# EAGLE design Adafruit LIS3MDL + LSM6DSOX FeatherWing (EAGLE 9.5.1)
COMPANY: ADAFRUIT INDUSTRIES; DRAWN: KTOWN; REV: A
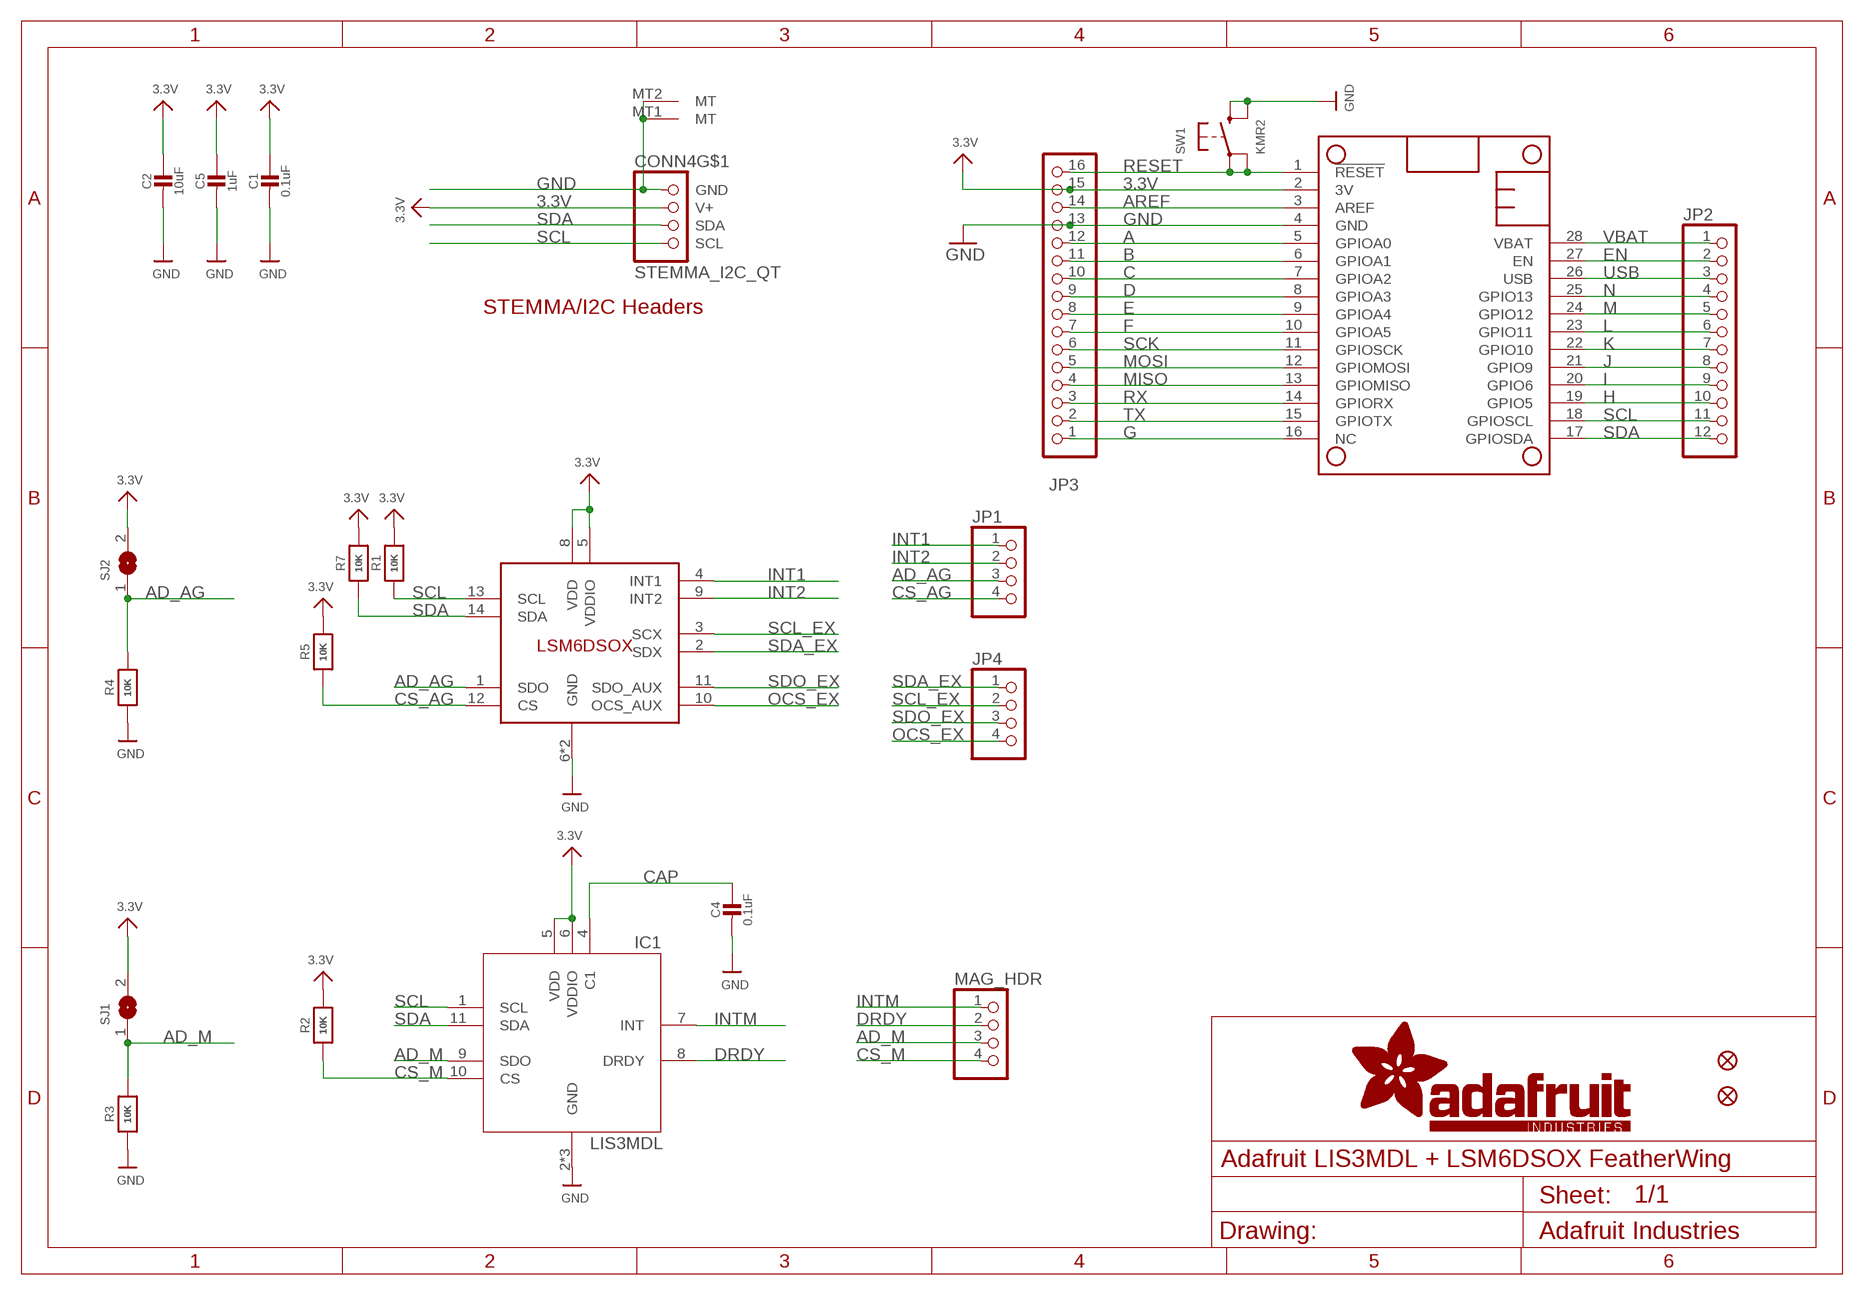
[diagram p0: schematic, sheet 1]

## Parts
C1  0.1uF  CAP_CERAMIC0603_NO  [0603-NO]
C2  10uF  CAP_CERAMIC0805-NOOUTLINE  [0805-NO]
C4  0.1uF  CAP_CERAMIC0603_NO  [0603-NO]
C5  1uF  CAP_CERAMIC0603_NO  [0603-NO]
CONN4  STEMMA_I2C_QT  [JST_SH4]
FID1  FIDUCIAL_1MM  [FIDUCIAL_1MM]
FID2  FIDUCIAL_1MM  [FIDUCIAL_1MM]
IC1  LIS3MDL  [LGA12_2X2MM]
JP1  HEADER-1X4ROUND  [1X04_ROUND]
JP2  HEADER-1X12  [1X12_ROUND]
JP3  HEADER-1X16ROUND  [1X16_ROUND]
JP4  HEADER-1X4ROUND  [1X04_ROUND]
MAG_HDR  HEADER-1X4ROUND  [1X04_ROUND]
MS1  FEATHERWING  [FEATHERWING]
R1  10K  RESISTOR_0603_NOOUT  [0603-NO]
R2  10K  RESISTOR_0603_NOOUT  [0603-NO]
R3  10K  RESISTOR_0603_NOOUT  [0603-NO]
R4  10K  RESISTOR_0603_NOOUT  [0603-NO]
R5  10K  RESISTOR_0603_NOOUT  [0603-NO]
R7  10K  RESISTOR_0603_NOOUT  [0603-NO]
SJ1  SOLDERJUMPER  [SOLDERJUMPER_ARROW_NOPASTE]
SJ2  SOLDERJUMPER  [SOLDERJUMPER_ARROW_NOPASTE]
SW1  KMR2  SWITCH_TACT_SMT4.6X2.8  [BTN_KMR2_4.6X2.8]
U$35  LSM6DSOX  [LGA-14L]

## Nets
3.3V [lowpower]: C1.1 C2.1 C5.1 CONN4.2(V+) IC1.5(VDD) IC1.6(VDDIO) JP3.15 MS1.2(3V) R1.2 R2.2 R5.2 R7.2 SJ1.2 SJ2.2 U$35.5(VDDIO) U$35.8(VDD)
A: JP3.12 MS1.5(GPIOA0)
AD_AG: JP1.3 R4.2 SJ2.1 U$35.1(SDO)
AD_M: IC1.9(SDO) MAG_HDR.3 R3.2 SJ1.1
AREF: JP3.14 MS1.3(AREF)
B: JP3.11 MS1.6(GPIOA1)
C: JP3.10 MS1.7(GPIOA2)
CAP: C4.1 IC1.4(C1)
CS_AG: JP1.4 R5.1 U$35.12(CS)
CS_M: IC1.10(CS) MAG_HDR.4 R2.1
D: JP3.9 MS1.8(GPIOA3)
DRDY: IC1.8(DRDY) MAG_HDR.2
E: JP3.8 MS1.9(GPIOA4)
EN: JP2.2 MS1.27(EN)
F: JP3.7 MS1.10(GPIOA5)
G: JP3.1 MS1.16(NC)
GND [lowpower]: C1.2 C2.2 C4.2 C5.2 CONN4.1(GND) CONN4.MT1(MT) CONN4.MT2(MT) IC1.2(GND) IC1.3(GND) IC1.12(GND) JP3.13 MS1.4(GND) R3.1 R4.1 SW1.B'(S1) SW1.B(S) U$35.6(GND) U$35.7(GND)
H: JP2.10 MS1.19(GPIO5)
I: JP2.9 MS1.20(GPIO6)
INT1: JP1.1 U$35.4(INT1)
INT2: JP1.2 U$35.9(INT2)
INTM: IC1.7(INT) MAG_HDR.1
J: JP2.8 MS1.21(GPIO9)
K: JP2.7 MS1.22(GPIO10)
L: JP2.6 MS1.23(GPIO11)
M: JP2.5 MS1.24(GPIO12)
MISO: JP3.4 MS1.13(GPIOMISO)
MOSI: JP3.5 MS1.12(GPIOMOSI)
N: JP2.4 MS1.25(GPIO13)
OCS_EX: JP4.4 U$35.10(OCS_AUX)
RESET: JP3.16 MS1.1(!RESET) SW1.A'(P1) SW1.A(P)
RX: JP3.3 MS1.14(GPIORX)
SCK: JP3.6 MS1.11(GPIOSCK)
SCL: CONN4.4(SCL) IC1.1(SCL) JP2.11 MS1.18(GPIOSCL) R1.1 U$35.13(SCL)
SCL_EX: JP4.2 U$35.3(SCX)
SDA: CONN4.3(SDA) IC1.11(SDA) JP2.12 MS1.17(GPIOSDA) R7.1 U$35.14(SDA)
SDA_EX: JP4.1 U$35.2(SDX)
SDO_EX: JP4.3 U$35.11(SDO_AUX)
TX: JP3.2 MS1.15(GPIOTX)
USB: JP2.3 MS1.26(USB)
VBAT: JP2.1 MS1.28(VBAT)

## Notes on the sheet
- STEMMA/I2C Headers

## Library data of the parts
C1 C2 C4 C5 = microbuilder:CAP_CERAMIC: Ceramic Capacitors For new designs, use the packages preceded by an '_' character since they are more reliable: The following footprints should be used on most boards: _0402 - Standard footprint for regular board layouts _0603 - Standard footprint for regular board layouts _0805 - Standard footprint for regular board layouts _1206 - Standard footprint for regular board layouts For extremely tight-pitch boards where space is at a premium, the following 'micro-pitch' footprints can be used (smaller pads, no silkscreen outline, etc.): _0402MP - Micro-pitch footprint for very dense/compact boards _0603MP - Micro-pitch footprint for very dense/compact boards _0805MP - Micro-pitch footprint for very dense/compact boards _1206MP - Micro-pitch footprint for very dense/compact boards
CONN4 = microbuilder:STEMMA_I2C
FID1 FID2 = microbuilder:FIDUCIAL: Fiducial Alignment Points Various fiducial points for machine vision alignment.; BOM: EXCLUDE
IC1 = adafruit_sensor:LIS3MDL: Digital output magnetic sensor. ultra-low-power, high-performance 3-axis magnetometer
JP1 JP4 MAG_HDR = microbuilder:HEADER-1X4: PIN HEADER
JP2 = microbuilder:HEADER-1X12
JP3 = microbuilder:HEADER-1X16: PIN HEADER
MS1 = microbuilder:FEATHERWING
R1-R5 R7 = microbuilder:RESISTOR: Resistors For new designs, use the packages preceded by an '_' character since they are more reliable: The following footprints should be used on most boards: _0402 - Standard footprint for regular board layouts _0603 - Standard footprint for regular board layouts _0805 - Standard footprint for regular board layouts _1206 - Standard footprint for regular board layouts For extremely tight-pitch boards where space is at a premium, the following 'micro-pitch' footprints can be used (smaller pads, no silkscreen outline, etc.): _0402MP - Micro-pitch footprint for very dense/compact boards _0603MP - Micro-pitch footprint for very dense/compact boards _0805MP - Micro-pitch footprint for very dense/compact boards _1206MP - Micro-pitch footprint for very dense/compact boards
SJ1 SJ2 = microbuilder:SOLDERJUMPER: SMD Solder JUMPER Solder the two pads together to create a connection, or remove the solder to break it. REFLOW - Use this footprint for solder paste and reflow ovens. WAVE - Use this footprint for hand-soldering (larger pads). CLOSED - Has a trace between the two pads to ensure it is closed by default. The trace needs to be cut to disable the jumper, and can be closed again by creating a solder bridge between the two pads.; BOM: EXCLUDE
SW1 = microbuilder:SWITCH_TACT_SMT: SMT Tact Switches 6x6mm - Digikey: P12940SCT-ND KMR2 (4.6x2.8mm) - Digikey: 401-1426-1-ND EVQ-PQHB55 - Light Touch, 160GF (4.5x4.5mm) - Digikey: P8090SCT-ND KMT0 - KMT021 NGJ LHS (etc.) IP68/Waterproof - Digikey: CKN10289CT-ND
U$35 = adafruit_sensor:LSM6DSOX

## Net classes
1 highpower: width 0.406 mm, drill 0.483 mm
2 lowpower: width 0.305 mm, drill 0.483 mm

## Board
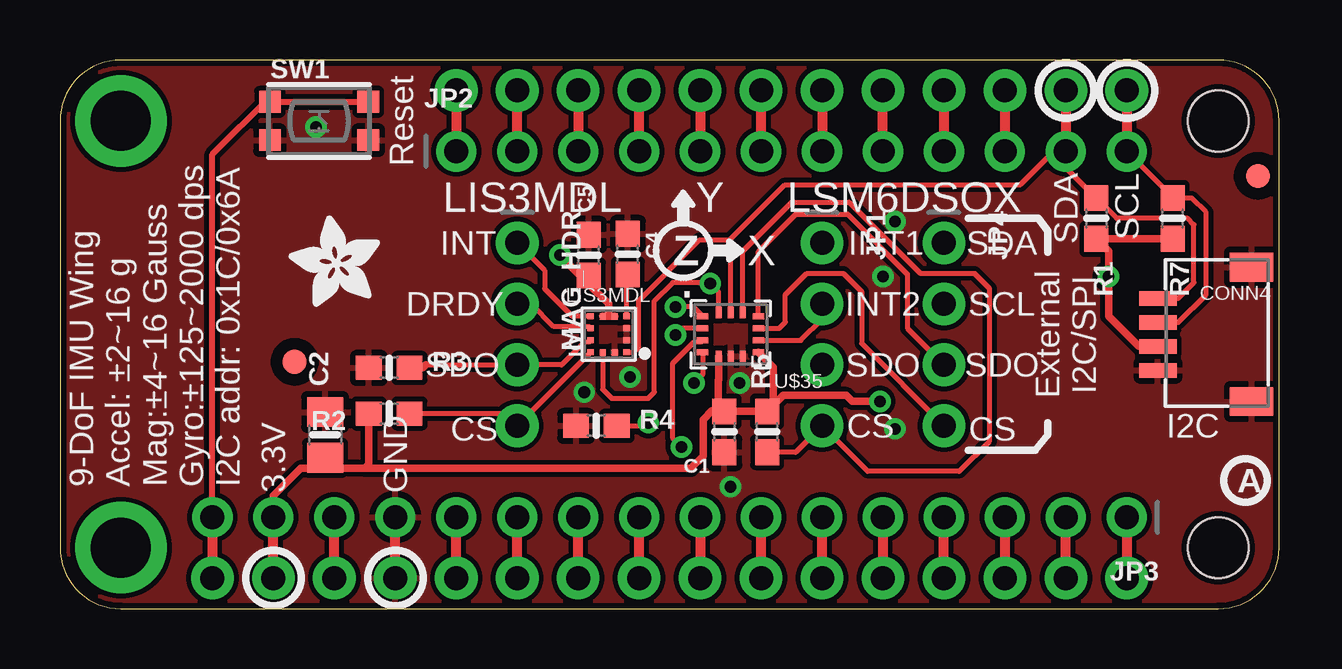
[diagram p1: board, top side]
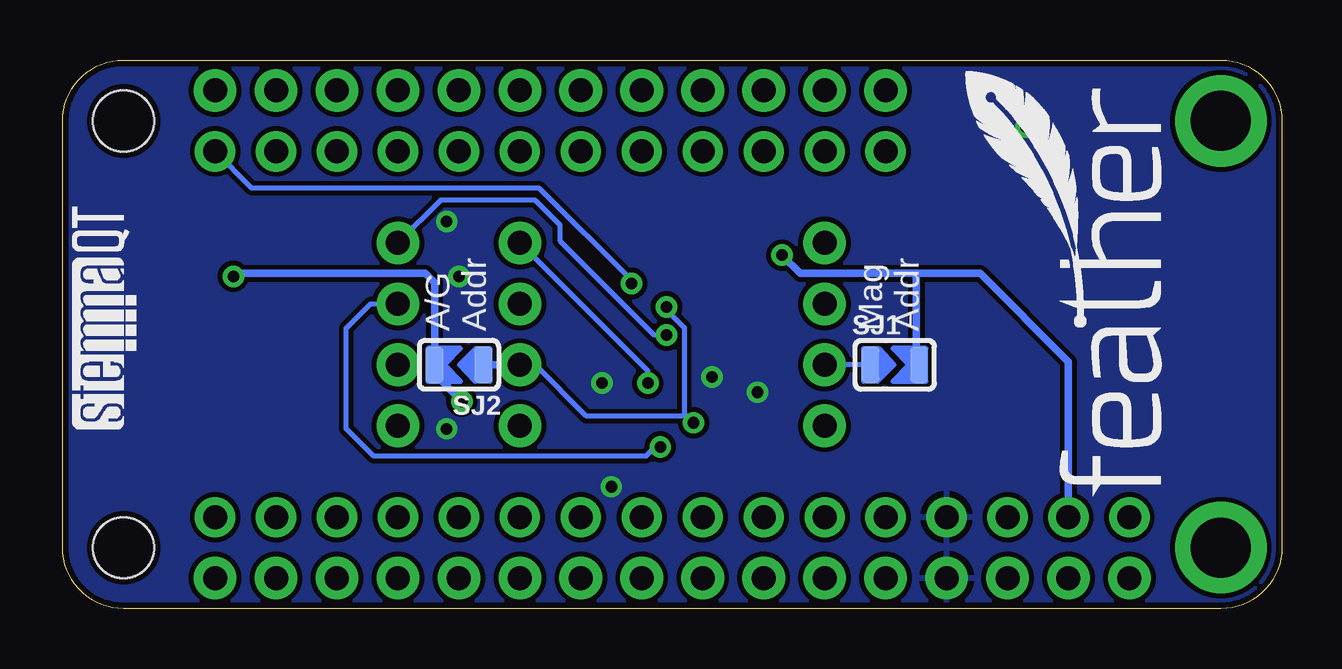
[diagram p2: board, bottom side, seen from below]

Size 50.8 x 22.86 mm. Coordinates in mm from the lower left corner, seen from the top.
Copper layers (1*16): Top 0.035mm / dielectric 1.5mm / Bottom 0.035mm
Design rules "adafruit *": minimum track width 8mil, minimum drill 15.5mil, track to track 8mil, track to pad 8mil, pad to pad 8mil, via to via 8mil, smd to smd 8mil, copper to edge 10mil, drill to drill 8mil, minimum pad ring 10mil, minimum via ring 8mil, stop-mask expansion 2mil, vias tented up to drill 20mil, thermal gap 10mil

### Footprints (pad centres in the part's own frame; a part is rotated, then mirrored left to right if it is on the bottom)
0603-NO = smd 1.075 x 1: 1 -0.85,0; 2 0.85,0
0805-NO = smd 1.24 x 1.5: 1 -0.95,0; 2 0.95,0
JST_SH4 = smd 0.6 x 1.55: 1 -1.5,2.514; 2 -0.5,2.514; 3 0.5,2.514; 4 1.5,2.514 | smd 1.2 x 1.8: MT1 -2.8,-1.386; MT2 2.8,-1.386
FIDUCIAL_1MM = smd 1 x 1: 1 0,0
LGA12_2X2MM = smd 0.275 x 0.25: 1 -0.75,0.75; 2 -0.75,0.25; 3 -0.75,-0.25; 4 -0.75,-0.75; 7 0.75,-0.75; 8 0.75,-0.25; 9 0.75,0.25; 10 0.75,0.75 | smd 0.25 x 0.275: 5 -0.25,-0.75; 6 0.25,-0.75; 11 0.25,0.75; 12 -0.25,0.75
1X04_ROUND = drill 1 pad 1.778: 1 -3.81,0; 2 -1.27,0; 3 1.27,0; 4 3.81,0
1X12_ROUND = drill 1 pad 1.676: 1 -13.97,0; 2 -11.43,0; 3 -8.89,0; 4 -6.35,0; 5 -3.81,0; 6 -1.27,0; 7 1.27,0; 8 3.81,0; 9 6.35,0; 10 8.89,0; 11 11.43,0; 12 13.97,0
1X16_ROUND = drill 1 pad 1.676: 1 -19.05,0; 2 -16.51,0; 3 -13.97,0; 4 -11.43,0; 5 -8.89,0; 6 -6.35,0; 7 -3.81,0; 8 -1.27,0; 9 1.27,0; 10 3.81,0; 11 6.35,0; 12 8.89,0; 13 11.43,0; 14 13.97,0; 15 16.51,0; 16 19.05,0
FEATHERWING = drill 1 pad 1.778: 1 6.35,1.27; 2 8.89,1.27; 3 11.43,1.27; 4 13.97,1.27; 5 16.51,1.27; 6 19.05,1.27; 7 21.59,1.27; 8 24.13,1.27; 9 26.67,1.27; 10 29.21,1.27; 11 31.75,1.27; 12 34.29,1.27; 13 36.83,1.27; 14 39.37,1.27; 15 41.91,1.27; 16 44.45,1.27; 17 44.45,21.59; 18 41.91,21.59; 19 39.37,21.59; 20 36.83,21.59; 21 34.29,21.59; 22 31.75,21.59; 23 29.21,21.59; 24 26.67,21.59; 25 24.13,21.59; 26 21.59,21.59; 27 19.05,21.59; 28 16.51,21.59 | drill 2.5 pad 3.81: P$1 2.54,20.32; P$2 2.54,2.54 | hole 2.54: 48.26,20.32; 48.26,2.54
SOLDERJUMPER_ARROW_NOPASTE = smd 0.762 x 1.524: 1 -1.016,0; 2 1.016,0
BTN_KMR2_4.6X2.8 = smd 0.9 x 0.9: A 2.05,0.8; A' -2.05,0.8; B 2.05,-0.8; B' -2.05,-0.8
LGA-14L = smd 0.475 x 0.25: 1 -1.163,0.75; 2 -1.163,0.25; 3 -1.163,-0.25; 4 -1.163,-0.75; 8 1.163,-0.75; 9 1.163,-0.25; 10 1.163,0.25; 11 1.163,0.75 | smd 0.25 x 0.475: 5 -0.5,-0.912; 6 0,-0.912; 7 0.5,-0.912; 12 0.5,0.912; 13 0,0.912; 14 -0.5,0.912

### Placement (x,y rotation side)
C1  27.69,7.37 270 top
C2  11.05,7.24 90 top
C4  23.66,14.77 90 top
C5  22.03,14.73 90 top
CONN4  48.26,11.43 90 top
FID1  9.78,10.29 0 top
FID2  49.91,18.03 0 top
IC1  22.86,11.43 180 top
JP1  31.75,11.43 270 top
JP2  30.48,19.05 0 top
JP3  25.4,3.81 180 top
JP4  36.83,11.43 270 top
MAG_HDR  19.05,11.43 270 top
MS1  0,0 0 top
R1  43.18,16.26 270 top
R2  13.72,8.13 180 top
R3  13.72,10.03 0 top
R4  22.35,7.62 0 top
R5  29.46,7.37 90 top
R7  46.35,16.26 270 top
SJ1  16.13,10.16 0 bottom
SJ2  34.29,10.16 180 bottom
SW1  10.79,20.32 0 top
U$13  [FEATHERLOGO_MED]  4.95,4.57 90 bottom
U$31  [STEMMAQT]  47.75,7.49 90 bottom
U$35  27.94,11.43 0 top
U$50  [ADAFRUIT_3.5MM]  13.34,12.57 90 top
U$51  [PCBFEAT-REV-040]  49.4,5.33 0 top

### Tracks (layer width: path | path; a pad name or v marks a point on that pad's centre or on a via)
3.3V  (via drill 0.48)
  Top 0.305: U$35.5 27.44,9.53 27.43,9.53 27.43,8.47 27.67,8.24 | U$35.8 29.72,10.06 29.72,8.47 | IC1.5 22.86,12.18 | 22.86,12.18 IC1.6 | 22.86,12.18 22.86,12.7 22.1,13.46 | 22.1,13.46 21.97,13.59 | 21.97,13.59 v20.83,14.73 | 12.7,5.84 26.29,5.84 26.8,6.35 26.8,7.87 27.16,8.24 27.67,8.24 | 12.7,5.84 11.05,5.84 | 11.05,5.84 10.03,5.84 8.89,4.7 JP3.15 | R7.2 R1.2 43.69,14.9 v43.69,13.84 43.69,12.19 44.95,10.93 CONN4.2 | 22.1,13.46 22.1,13.82 C5.1 21.97,13.82 21.97,13.59 | R2.2 12.87,6.01 12.7,5.84 | v34.16,8.64 33.02,8.64 32.77,8.89 30.14,8.89 29.72,8.47 | 29.72,8.47 R5.2 C1.1 27.67,8.24 | C2.1 11.05,5.84
  Top 0.406: MS1.2 JP3.15
  Bottom 0.305: v20.83,14.73 20.07,13.97 15.24,13.97 | 15.24,13.97 12.57,13.97 8.89,10.29 JP3.15 | 15.24,13.97 15.24,10.29 SJ1.2 | v43.69,13.84 43.56,13.97 35.69,13.97 35.31,13.59 SJ2.2 35.31,9.78 v34.16,8.64
A
  Top 0.406: MS1.5 JP3.12
AD_AG  (via drill 0.48)
  Top 0.203: U$35.1 26.38,12.57 v25.64,12.57 | R4.2 24.38,7.62 v24.51,7.75
  Bottom 0.203: v25.64,12.57 25.64,12.46 24.89,11.71 24.89,8.13 | 24.89,8.13 24.89,8.02 28.98,8.02 31.11,10.16 JP1.3 | v24.51,7.75 24.89,8.13
  Bottom 0.305: SJ2.1 JP1.3
AD_M
  Top 0.203: IC1.9 22.04,11.11 21.85,11.11 20.9,10.16 MAG_HDR.3 15.24,10.16
  Top 0.305: 15.24,10.16 15.11,10.03 R3.2
  Bottom 0.203: SJ1.1 MAG_HDR.3
AREF
  Top 0.406: MS1.3 JP3.14
B
  Top 0.406: MS1.6 JP3.11
C
  Top 0.406: MS1.7 JP3.10
CAP
  Top 0.203: IC1.4 23.61,13.87 C4.1
CS_AG
  Top 0.203: U$35.12 28.44,14.89 30.49,16.94 32.88,16.94 35.85,13.97 38.1,13.97 38.73,13.34 38.73,6.99 37.47,5.71 33.66,5.71 JP1.4 30.65,6.52 R5.1
CS_M
  Top 0.203: IC1.10 MAG_HDR.4 18.54,8.13 R2.1
D
  Top 0.406: MS1.8 JP3.9
DRDY
  Top 0.203: IC1.8 22.04,11.75 20.58,11.75 19.63,12.7 MAG_HDR.2
E
  Top 0.406: JP3.8 MS1.9
EN
  Top 0.406: JP2.2 MS1.27
F
  Top 0.406: MS1.10 JP3.7
G
  Top 0.406: JP3.1 MS1.16
GND  (via drill 0.48)
  Top 0.406: MS1.4 JP3.13
  other vias: 10.67,20.07 21.84,9.02 23.75,9.65 28.32,9.4 34.29,13.84 34.8,7.49 34.8,16.13 27.94,5.08
  pour Top: 0,22.86 50.8,22.86 50.8,0 0,0
  pour Bottom: 0,22.86 50.8,22.86 50.8,0 0,0
H
  Top 0.406: MS1.19 JP2.10
I
  Top 0.406: MS1.20 JP2.9
INT1  (via drill 0.48)
  Top 0.203: U$35.4 26.78,9.76 v26.42,9.4
  Bottom 0.203: v26.42,9.4 26.42,9.91 JP1.1
INT2
  Top 0.203: U$35.9 30.86,11.18 31.75,12.06 JP1.2
INTM
  Top 0.203: IC1.7 21.35,12.18 20.19,13.34 20.19,14.1 MAG_HDR.1
J
  Top 0.406: JP2.8 MS1.21
K
  Top 0.406: MS1.22 JP2.7
L
  Top 0.406: JP2.6 MS1.23
M
  Top 0.406: MS1.24 JP2.5
MISO
  Top 0.406: MS1.13 JP3.4
MOSI
  Top 0.406: JP3.5 MS1.12
N
  Top 0.406: JP2.4 MS1.25
OCS_EX
  Top 0.203: JP4.4 33.4,11.05 33.4,13.21 32.64,13.97 31.11,13.97 30.23,13.08 30.23,11.94 29.97,11.68 U$35.10
RESET
  Top 0.254: JP3.16 6.35,18.92 8.74,21.32 SW1.A' SW1.A
  Top 0.406: JP3.16 MS1.1
RX
  Top 0.406: JP3.3 MS1.14
SCK
  Top 0.406: MS1.11 JP3.6
SCL
  Top 0.203: IC1.1 23.62,10.67 23.88,10.67 24.11,10.9 24.11,12.83 26.64,15.37 27.91,15.37 | 27.91,15.37 30.2,17.65 40.01,17.65 41.4,19.05 JP2.11 41.91,18.38 R1.1 44.03,16.26 46.99,16.26 47.24,16 47.24,13.59 46.59,12.93 CONN4.4 | 27.91,15.37 27.94,15.37 U$35.13
  Top 0.406: MS1.18 JP2.11
SCL_EX  (via drill 0.48)
  Top 0.203: U$35.3 26.71,11.11 26.41,11.11 25.52,10.21 25.52,7.12 v25.9,6.74
  Bottom 0.203: v25.9,6.74 26.11,6.74 26.5,6.35 37.85,6.35 38.99,7.49 38.99,11.68 37.97,12.7 JP4.2
SDA  (via drill 0.48)
  Top 0.203: U$35.14 27.44,13.2 v27.09,13.55 27.05,13.59 25.53,13.59 24.77,12.83 24.77,9.02 24.51,8.76 22.99,8.76 22.61,9.14 IC1.11 | JP2.12 46.35,17.14 R7.1 47.16,17.11 47.75,16.51 47.75,13.08 46.6,11.93 CONN4.3
  Top 0.406: MS1.17 JP2.12
  Bottom 0.203: v27.09,13.55 27.09,13.67 30.94,17.53 42.93,17.53 JP2.12
SDA_EX  (via drill 0.48)
  Top 0.203: U$35.2 25.92,11.68 v25.64,11.4
  Bottom 0.203: JP4.1 35.05,17.02 31.11,17.02 30.09,15.99 30.09,15.33 26.15,11.4 v25.64,11.4
SDO_EX
  Top 0.203: U$35.11 29.1,14.88 30.66,16.43 32.81,16.43 35.31,13.94 35.31,11.68 JP4.3
TX
  Top 0.406: MS1.15 JP3.2
USB
  Top 0.406: MS1.26 JP2.3
VBAT
  Top 0.406: MS1.28 JP2.1

### Text on the board
tPlace: Reset | Y | SDA | SCL | LIS3MDL | LSM6DSOX | INT | INT1 | SDA | Z | X | DRDY | INT2 | SCL | External / I2C/SPI | SDO | SDO | SDO | CS | I2C | CS | CS | 9-DoF IMU Wing / Accel: ±2~16 g / Mag:±4~16 Gauss / Gyro:±125~2000 dps / I2C addr: 0x1C/0x6A | 3.3V | GND
bPlace: Mag / Addr | A/G / Addr